# Altium schematic sheet PLD_Sensors_AVR_Interface.SchDoc: Gyroscopes Buffer
size A3; SheetTotal: 32
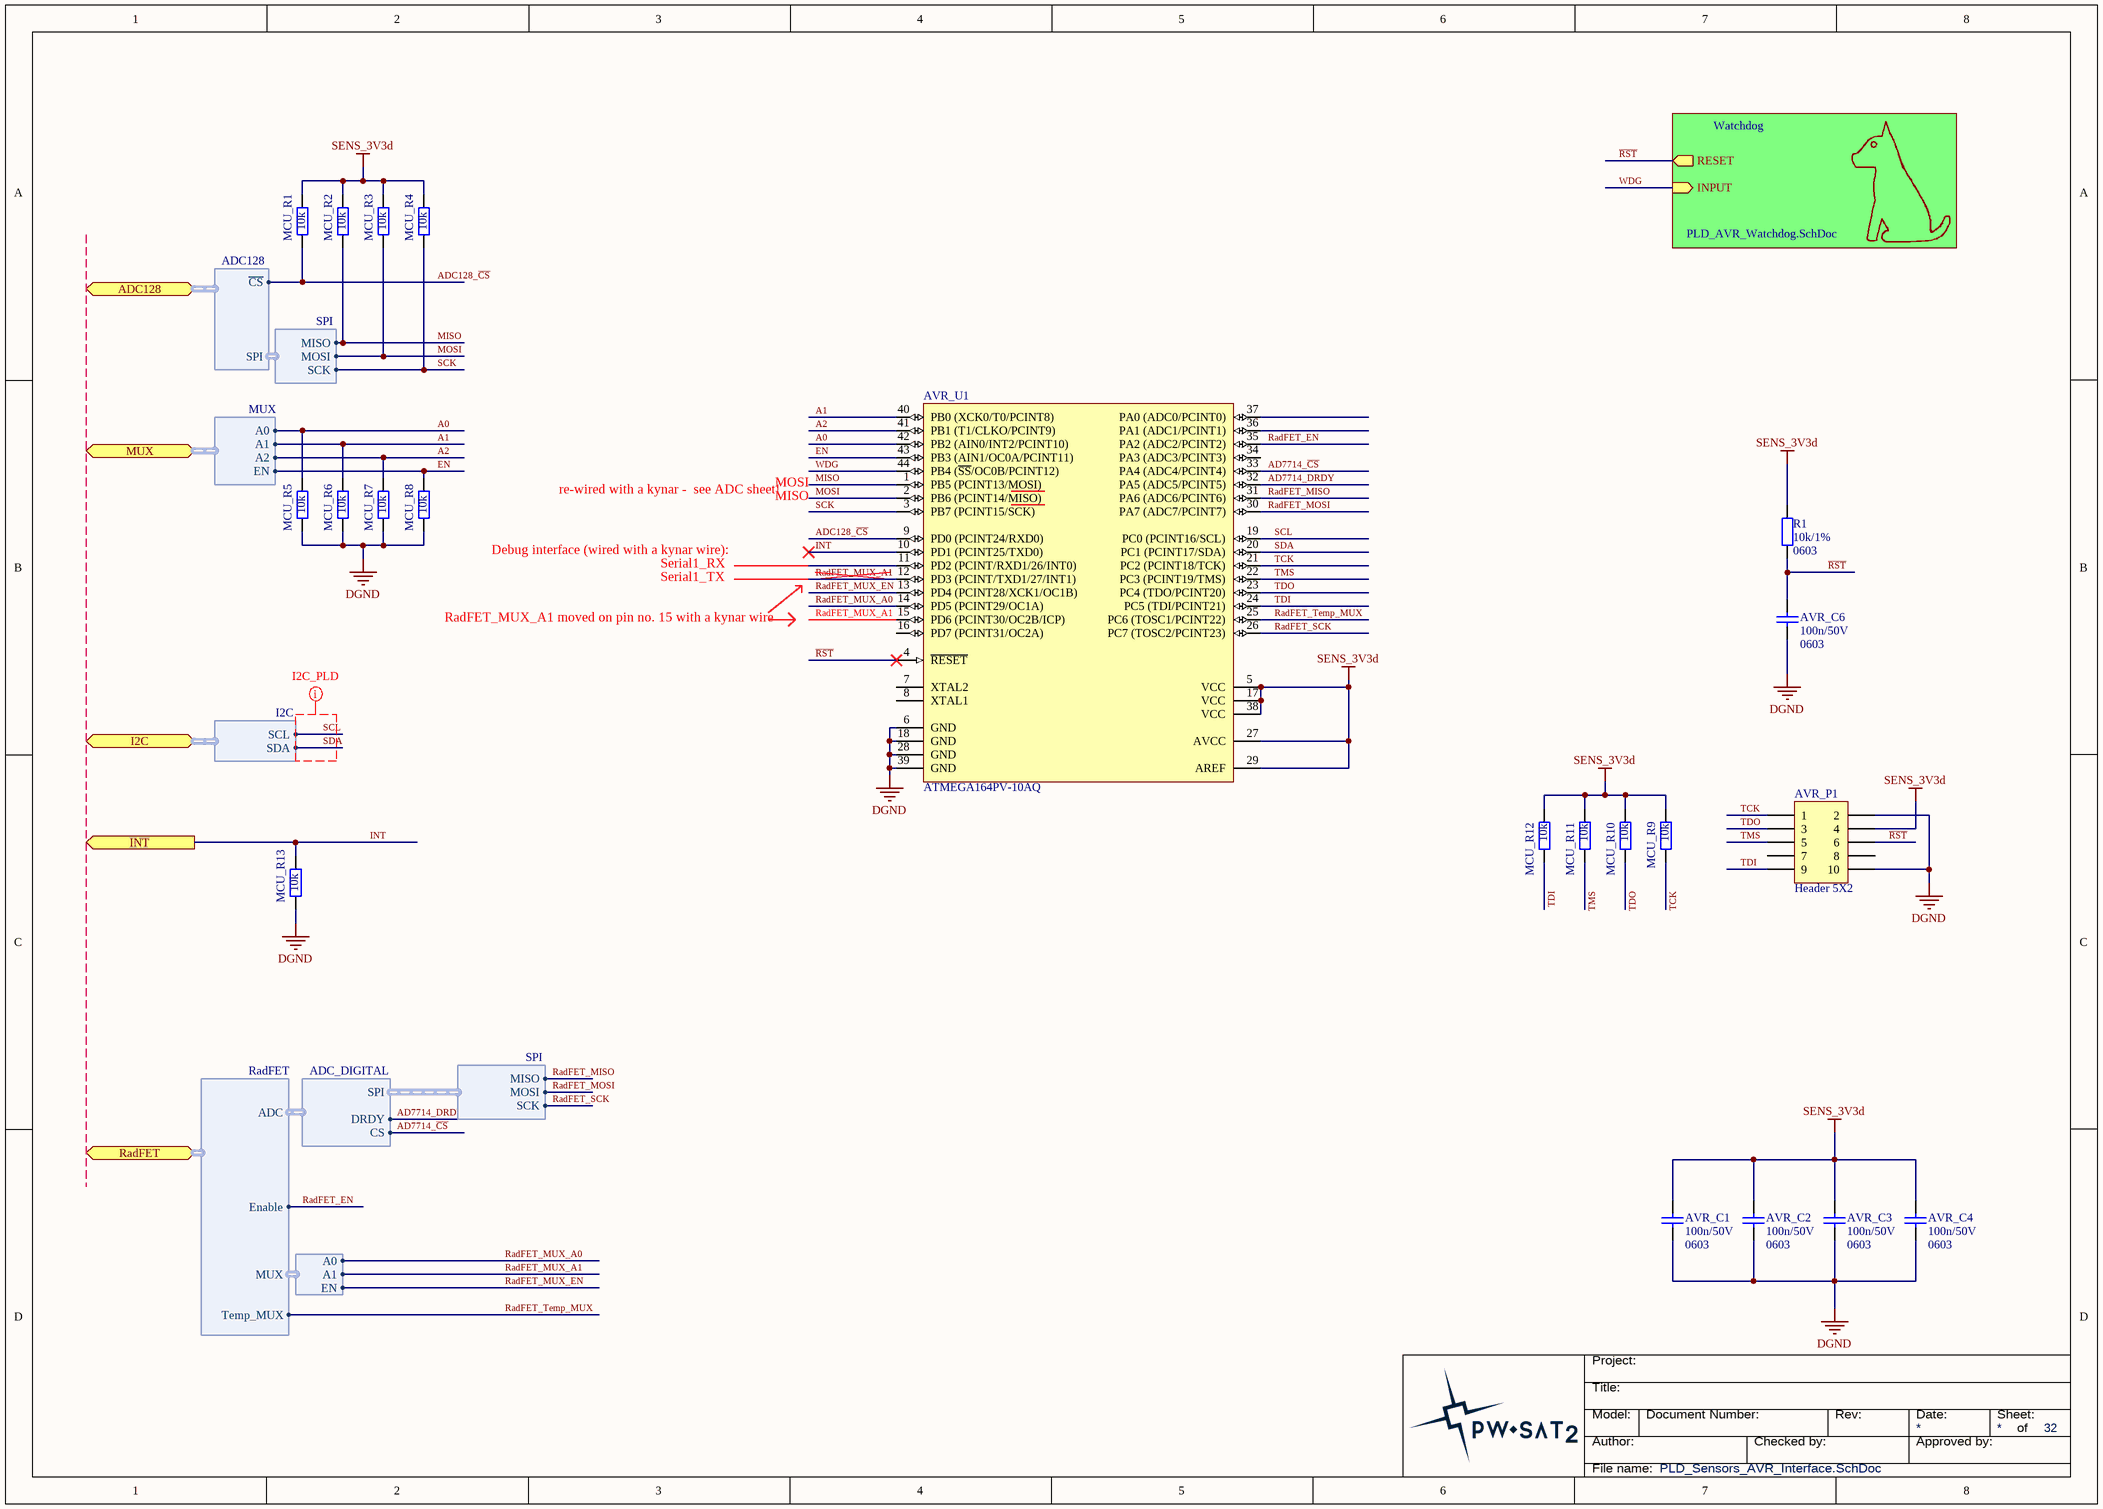
[diagram p0: PLD_Sensors_AVR_Interface.SchDoc]

## Parts
AVR_C1  Package: 0603  [SMD_Capacitor_0603]  (hidden comment: 100n/50V)
AVR_C2  Package: 0603  [SMD_Capacitor_0603]  (hidden comment: 100n/50V)
AVR_C3  Package: 0603  [SMD_Capacitor_0603]  (hidden comment: 100n/50V)
AVR_C4  Package: 0603  [SMD_Capacitor_0603]  (hidden comment: 100n/50V)
AVR_C6  Package: 0603  [SMD_Capacitor_0603]  (hidden comment: 100n/50V)
AVR_P1  Header 5X2  [HDR2X5]
AVR_U1  ATMEGA164PV-10AQ  [TQFP-44]
MCU_R1  10k  [SMD_Resistor_0603]
MCU_R2  10k  [SMD_Resistor_0603]
MCU_R3  10k  [SMD_Resistor_0603]
MCU_R4  10k  [SMD_Resistor_0603]
MCU_R5  10k  [SMD_Resistor_0603]
MCU_R6  10k  [SMD_Resistor_0603]
MCU_R7  10k  [SMD_Resistor_0603]
MCU_R8  10k  [SMD_Resistor_0603]
MCU_R9  10k  [SMD_Resistor_0603]
MCU_R10  10k  [SMD_Resistor_0603]
MCU_R11  10k  [SMD_Resistor_0603]
MCU_R12  10k  [SMD_Resistor_0603]
MCU_R13  10k  [SMD_Resistor_0603]
R1  Package: 0603  [SMD_Resistor_0603]  (hidden comment: 10k/1%)

## Sub-sheets
Watchdog = PLD_AVR_Watchdog.SchDoc: RESET (out), INPUT (in)

## Ports
ADC128 (harness ADC128), I2C (harness I2C), INT (out), MUX (harness MUX), RadFET (harness RadFET)

## Harnesses
I2C: SDA, SCL
SPI: MISO, MOSI, SCK
ADC128: SPI, ~{CS}
MUX: A0, A1, A2, EN
ADC_DIGITAL: DRDY, CS, SPI
ADG709_MUX: A0, A1, EN
RadFET: ADC, MUX, Enable, Temp_MUX

## Nets
DGND: AVR_C1.2 AVR_C2.2 AVR_C3.2 AVR_C4.2 AVR_C6.2 AVR_P1.2 AVR_P1.10 AVR_U1.6(GND) AVR_U1.18(GND) AVR_U1.28(GND) AVR_U1.39(GND) MCU_R5.1 MCU_R6.1 MCU_R7.1 MCU_R8.1 MCU_R13.2
SENS_3V3d: AVR_C1.1 AVR_C2.1 AVR_C3.1 AVR_C4.1 AVR_P1.4 AVR_U1.5(VCC) AVR_U1.17(VCC) AVR_U1.27(AVCC) AVR_U1.29(AREF) AVR_U1.38(VCC) MCU_R1.1 MCU_R2.1 MCU_R3.1 MCU_R4.1 MCU_R9.1 MCU_R10.1 MCU_R11.1 MCU_R12.1 R1.1
A0: AVR_U1.42(PB2_(AIN0/INT2/PCINT10)) MCU_R5.2 ; port MUX.A0
A1: AVR_U1.40(PB0_(XCK0/T0/PCINT8)) MCU_R6.2 ; port MUX.A1
A2: AVR_U1.41(PB1_(T1/CLKO/PCINT9)) MCU_R7.2 ; port MUX.A2
AD7714_~{CS}: AVR_U1.33(PA4_(ADC4/PCINT4)) ; harness ADC_DIGITAL.CS
AD7714_DRDY: AVR_U1.32(PA5_(ADC5/PCINT5)) ; harness ADC_DIGITAL.DRDY
ADC128_~{CS}: AVR_U1.9(PD0_(PCINT24/RXD0)) MCU_R1.2 ; port ADC128.~{CS}
EN: AVR_U1.43(PB3_(AIN1/OC0A/PCINT11)) MCU_R8.2 ; port MUX.EN
INT: AVR_U1.10(PD1_(PCINT25/TXD0)) MCU_R13.1 ; port INT
MISO: AVR_U1.1(PB5_(PCINT13/MOSI)) MCU_R2.2 ; harness SPI.MISO
MOSI: AVR_U1.2(PB6_(PCINT14/MISO)) MCU_R3.2 ; harness SPI.MOSI
~{RST}: AVR_C6.1 AVR_P1.6 AVR_U1.4(~{RESET}) R1.2 ; sheet Watchdog/RESET
RadFET_EN: AVR_U1.35(PA2_(ADC2/PCINT2)) ; port RadFET.Enable
RadFET_MISO: AVR_U1.31(PA6_(ADC6/PCINT6)) ; harness SPI.MISO
RadFET_MOSI: AVR_U1.30(PA7_(ADC7/PCINT7)) ; harness SPI.MOSI
RadFET_MUX_A0: AVR_U1.14(PD5_(PCINT29/OC1A)) ; harness ADG709_MUX.A0
RadFET_MUX_A1: AVR_U1.12(PD3_(PCINT/TXD1/27/INT1)) ; harness ADG709_MUX.A1
RadFET_MUX_EN: AVR_U1.13(PD4_(PCINT28/XCK1/OC1B)) ; harness ADG709_MUX.EN
RadFET_SCK: AVR_U1.26(PC7_(TOSC2/PCINT23)) ; harness SPI.SCK
RadFET_Temp_MUX: AVR_U1.25(PC6_(TOSC1/PCINT22)) ; port RadFET.Temp_MUX
SCK: AVR_U1.3(PB7_(PCINT15/SCK)) MCU_R4.2 ; harness SPI.SCK
SCL: AVR_U1.19(PC0_(PCINT16/SCL)) ; port I2C.SCL
SDA: AVR_U1.20(PC1_(PCINT17/SDA)) ; port I2C.SDA
TCK: AVR_P1.1 AVR_U1.21(PC2_(PCINT18/TCK)) MCU_R9.2
TDI: AVR_P1.9 AVR_U1.24(PC5_(TDI/PCINT21)) MCU_R12.2
TDO: AVR_P1.3 AVR_U1.23(PC4_(TDO/PCINT20)) MCU_R10.2
TMS: AVR_P1.5 AVR_U1.22(PC3_(PCINT19/TMS)) MCU_R11.2
WDG: AVR_U1.44(PB4_(~{SS}/OC0B/PCINT12)) ; sheet Watchdog/INPUT

Not connected (* = marked no-connect by the designer): AVR_P1 7 8; AVR_U1 7(XTAL2) 8(XTAL1) 11(PD2_(PCINT/RXD1/26/INT0)) 15(PD6_(PCINT30/OC2B/ICP)) 16(PD7_(PCINT31/OC2A)) 34(PA3_(ADC3/PCINT3)) 36(PA1_(ADC1/PCINT1)) 37(PA0_(ADC0/PCINT0))

## Layout directives
net class I2C_PLD: SCL, SDA

## Notes on the sheet
- re-wired with a kynar -  see ADC sheet!
- MOSI
- MISO
- Debug interface (wired with a kynar wire):
- Serial1_RX
- Serial1_TX
- RadFET_MUX_A1 moved on pin no. 15 with a kynar wire
- (near AVR_U1) RadFET_MUX_A1
- Title:
- Project:
- Author:
- Model:
- Document Number:
- Checked by:
- Rev:
- Date:
- Approved by:
- Sheet:
- of
- File name:

## Library data of the parts
AVR_C1-AVR_C4 AVR_C6 = Cer_C0603T104K5RALTU: Ceramic Cap Kemet COTS 100n/50V X7R 0603; Manufacturer: Kemet; ManufacturerPartNumber: C0603T104K5RALTU; Value: 100n/50V
AVR_P1 = Header 5X2: Header, 5-Pin, Dual row; LatestRevisionDate: 17-Jul-2002; LatestRevisionNote: Re-released for DXP Platform.; Publisher: Altium Limited
AVR_U1 = ATMEGA164PV-10AQ: General-purpose microcontroller; Value: ATMEGA164PV-10AQ
MCU_R1-MCU_R13 = Res: Value: 10k; Package: 0603
R1 = CRCW060310K0FKxxxx: 10k/1% Vishay CRCW 0603 Resistor. 100mW, 100ppm, 75V.; Manufacturer: Vishay; ManufacturerPartNumber: CRCW060310K0FKxxxx; Value: 10k/1%